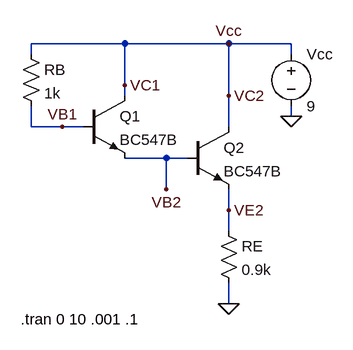
[diagram p0: schematic pol.asc]
pol.asc, the LTspice schematic file:
Version 4
SHEET 1 880 680
WIRE 176 32 32 32
WIRE 336 32 176 32
WIRE 432 32 336 32
WIRE 32 48 32 32
WIRE 432 48 432 32
WIRE 176 96 176 32
WIRE 176 112 176 96
WIRE 336 112 336 32
WIRE 432 144 432 128
WIRE 32 160 32 128
WIRE 80 160 32 160
WIRE 112 160 80 160
WIRE 336 160 336 112
WIRE 240 208 176 208
WIRE 272 208 240 208
WIRE 240 256 240 208
WIRE 336 288 336 256
WIRE 336 320 336 288
WIRE 336 432 336 400
FLAG 432 144 0
FLAG 336 432 0
FLAG 336 32 Vcc
FLAG 336 112 VC2
FLAG 336 288 VE2
FLAG 240 256 VB2
FLAG 80 160 VB1
FLAG 176 96 VC1
SYMBOL npn 112 112 R0
SYMATTR InstName Q1
SYMATTR Value BC547B
SYMBOL npn 272 160 R0
SYMATTR InstName Q2
SYMATTR Value BC547B
SYMBOL res 16 32 R0
SYMATTR InstName RB
SYMATTR Value 1k
SYMBOL voltage 432 32 R0
WINDOW 123 0 0 Left 0
WINDOW 39 0 0 Left 0
SYMATTR InstName Vcc
SYMATTR Value 9
SYMBOL res 320 304 R0
SYMATTR InstName RE
SYMATTR Value 0.9k
TEXT 16 456 Left 2 !.tran 0 10 .001 .1

The netlist it stands for:
* pol.asc
Q1 VC1 VB1 VB2 0 BC547B
Q2 VC1 VB2 VE2 0 BC547B
RB VC1 VB1 1k
Vcc VC1 0 9
RE VE2 0 0.9k
.model NPN NPN
.model PNP PNP
.lib standard.bjt
.tran 0 10 .001 .1
.backanno
.end